# EAGLE design v3 (EAGLE 8.5.1)

## Sheet 1 of 2
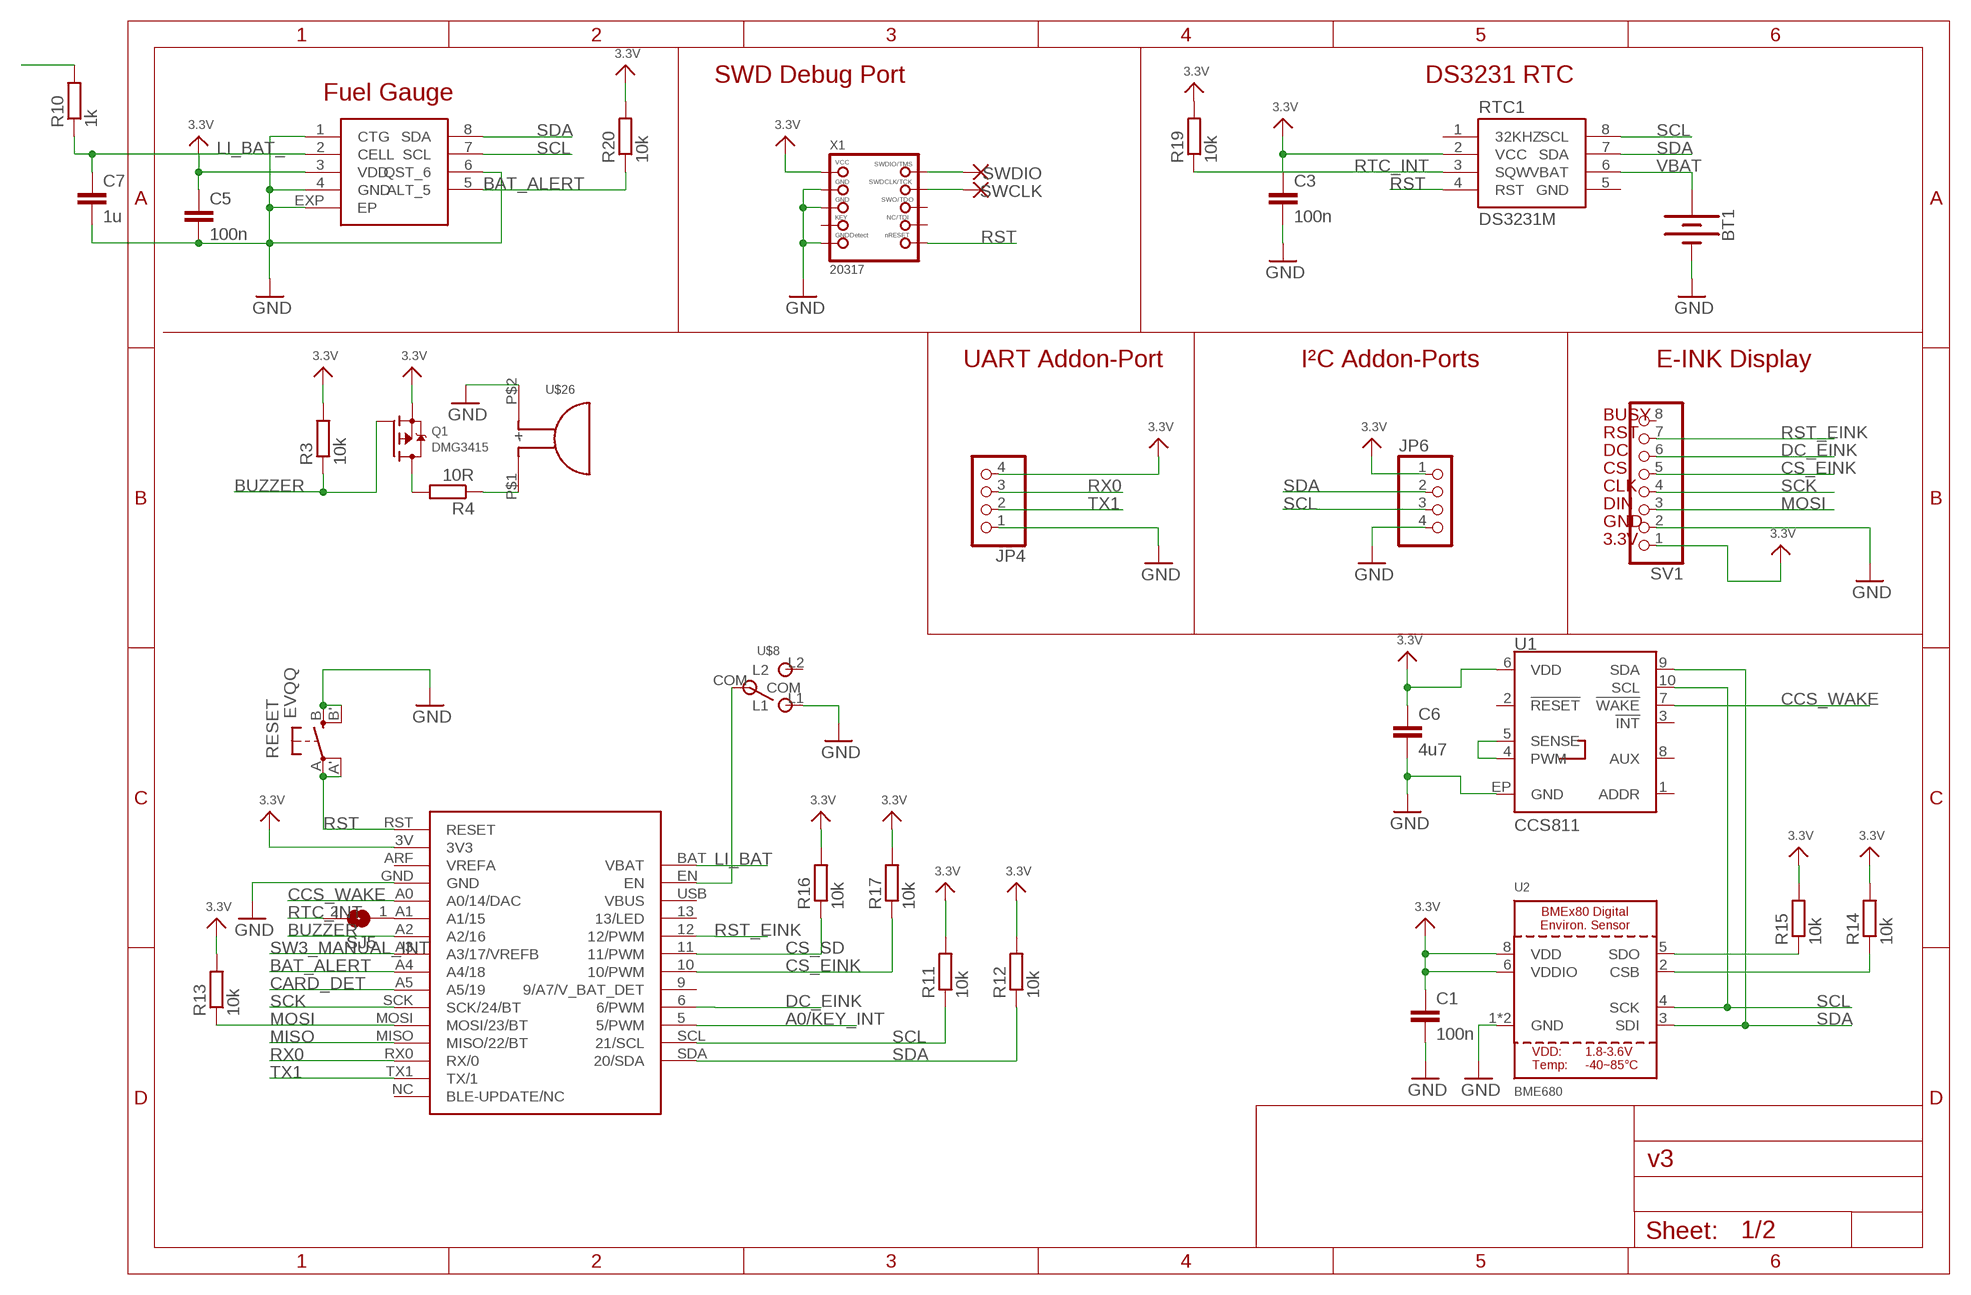
[diagram p0: schematic, sheet 1]

### Parts
BT1  BATTERY-12MM_SMD  [BATTCON_12MM]
C1  100n  C-EUC0805  [C0805]
C3  100n  C-EUC0805  [C0805]
C5  100n  C-EUC0805  [C0805]
C6  4u7  C-EUC0805  [C0805]
C7  1u  C-EUC0805  [C0805]
JP4  PINHD-1X04_2.54  [1X04]
JP6  PINHD-1X04_2.54-90°  [1X04/90]
Q1  DMG3415  MOSFET-PWIDE  [SOT23-WIDE]
R3  10k  R-EU_R0805  [R0805]
R4  10R  R-EU_R0805  [R0805]
R10  1k  R-EU_R0805  [R0805]
R11  10k  R-EU_R0805  [R0805]
R12  10k  R-EU_R0805  [R0805]
R13  10k  R-EU_R0805  [R0805]
R14  10k  R-EU_R0805  [R0805]
R15  10k  R-EU_R0805  [R0805]
R16  10k  R-EU_R0805  [R0805]
R17  10k  R-EU_R0805  [R0805]
R19  10k  R-EU_R0805  [R0805]
R20  10k  R-EU_R0805  [R0805]
RESET  EVQQ  SPST_TACT-EVQQ2  [EVQ-Q2]
RTC1  DS3231M  [SO08]
SJ5  SOLDERJUMPERCLOSED  [SOLDERJUMPER_CLOSEDWIRE]
SV1  PINHD-1X08_2.54  [1X08]
SWCLK  WIREPADSMD1,27-254  [SMD1,27-2,54]
SWDIO  WIREPADSMD1,27-254  [SMD1,27-2,54]
U1  CCS811  [LGA10]
U2  BME680  BME280  [BME280]
U$8  MSK-12C02_SMD_SPDT_SWITCH  [MSK-12C02]
U$15  FEATHER_M0  [FEATHER_M0]
U$26  DTS402G1  [DET402G1]
U$33  MAX17043  [DFN-2X3]
X1  20317  JTAG-CORTEXBOXPOSTS  [2X05_1.27MM_BOX_POSTS]

### Nets
3.3V: C1.1 C3.1 C5.1 C6.1 JP4.4 JP6.1 Q1.2(S) R3.2 R11.2 R12.2 R13.2 R14.2 R15.2 R16.2 R17.2 R19.2 R20.2 RTC1.2(VCC) SV1.1 U1.6(VDD) U2.6(VDDIO) U2.8(VDD) U$15.3V(3V3) U$33.3(VDD) X1.1(VCC) ; also sheet 2
A0/KEY_INT: U$15.5(5/PWM) ; also sheet 2
BAT_ALERT: R20.1 U$15.A4(A4/18) U$33.5(ALT_5)
BME_CSB: R14.1 U2.2(CSB)
BME_SDO: R15.1 U2.5(SDO)
BUZZER: Q1.1(G) R3.1 U$15.A2(A2/16)
CARD_DET: U$15.A5(A5/19) ; also sheet 2
CCS_WAKE: U1.7(!WAKE!) U$15.A0(A0/14/DAC)
CS_EINK: R17.1 SV1.5 U$15.10(10/PWM)
CS_SD: R16.1 U$15.11(11/PWM) ; also sheet 2
DC_EINK: SV1.6 U$15.6(6/PWM)
EN: U$8.COM U$15.EN
GND: BT1.GND(-) C1.2 C3.2 C5.2 C6.2 C7.2 JP4.1 JP6.4 RESET.B'(S1) RESET.B(S) SV1.2 U1.EP(GND) U2.1(GND) U2.7(GND) U$8.L1 U$15.GND U$26.P$2(-) U$33.1(CTG) U$33.4(GND) U$33.6(QST_6) U$33.EXP(EP) X1.3(GND) X1.5(GND) X1.9(GNDDETECT) ; also sheet 2
LI_BAT: R10.2 U$15.BAT(VBAT)
LI_BAT_: C7.1 R10.1 U$33.2(CELL)
MISO: U$15.MISO(MISO/22/BT) ; also sheet 2
MOSI: R13.1 SV1.3 U$15.MOSI(MOSI/23/BT) ; also sheet 2
N$8: Q1.3(D) R4.2
N$9: R4.1 U$26.P$1(+)
RST: RESET.A'(P1) RESET.A(P) RTC1.4(RST) U$15.RST(RESET) X1.10(NRESET)
RST_EINK: SV1.7 U$15.12(12/PWM)
RTC_INT: R19.1 RTC1.3(SQW) SJ5.2
RTC_INT_: SJ5.1 U$15.A1(A1/15)
RX0: JP4.3 U$15.RX0(RX/0)
SCK: SV1.4 U$15.SCK(SCK/24/BT) ; also sheet 2
SCL: JP6.3 R11.1 RTC1.8(SCL) U1.10(SCL) U2.4(SCK) U$15.SCL(21/SCL) U$33.7(SCL) ; also sheet 2
SDA: JP6.2 R12.1 RTC1.7(SDA) U1.9(SDA) U2.3(SDI) U$15.SDA(20/SDA) U$33.8(SDA) ; also sheet 2
SENSE_PWM: U1.4(PWM) U1.5(SENSE)
SW3_MANUAL_INT: U$15.A3(A3/17/VREFB) ; also sheet 2
SWCLK: SWCLK.1(P) X1.4(SWDCLK)
SWDIO: SWDIO.1(P) X1.2(SWDIO)
TX1: JP4.2 U$15.TX1(TX/1)
VBAT: BT1.PWR@1(+) RTC1.6(VBAT)
Unconnected: RTC1.1(32KHZ) SV1.8 U1.1(ADDR) U1.2(!RESET!) U1.3(!INT!) U1.8(AUX) U$8.L2 U$15.9(9/A7/V_BAT_DET) U$15.13(13/LED) U$15.ARF(VREFA) U$15.NC(BLE-UPDATE/NC) U$15.USB(VBUS) X1.6(SWO) X1.7(KEY) X1.8(TDI)

### Notes on the sheet
- SWD Debug Port | DS3231 RTC
- Fuel Gauge
- UART Addon-Port | I²C Addon-Ports | E-INK Display
- BUSY
- RST
- DC
- CS
- CLK
- DIN
- GND
- 3.3V

## Sheet 2 of 2
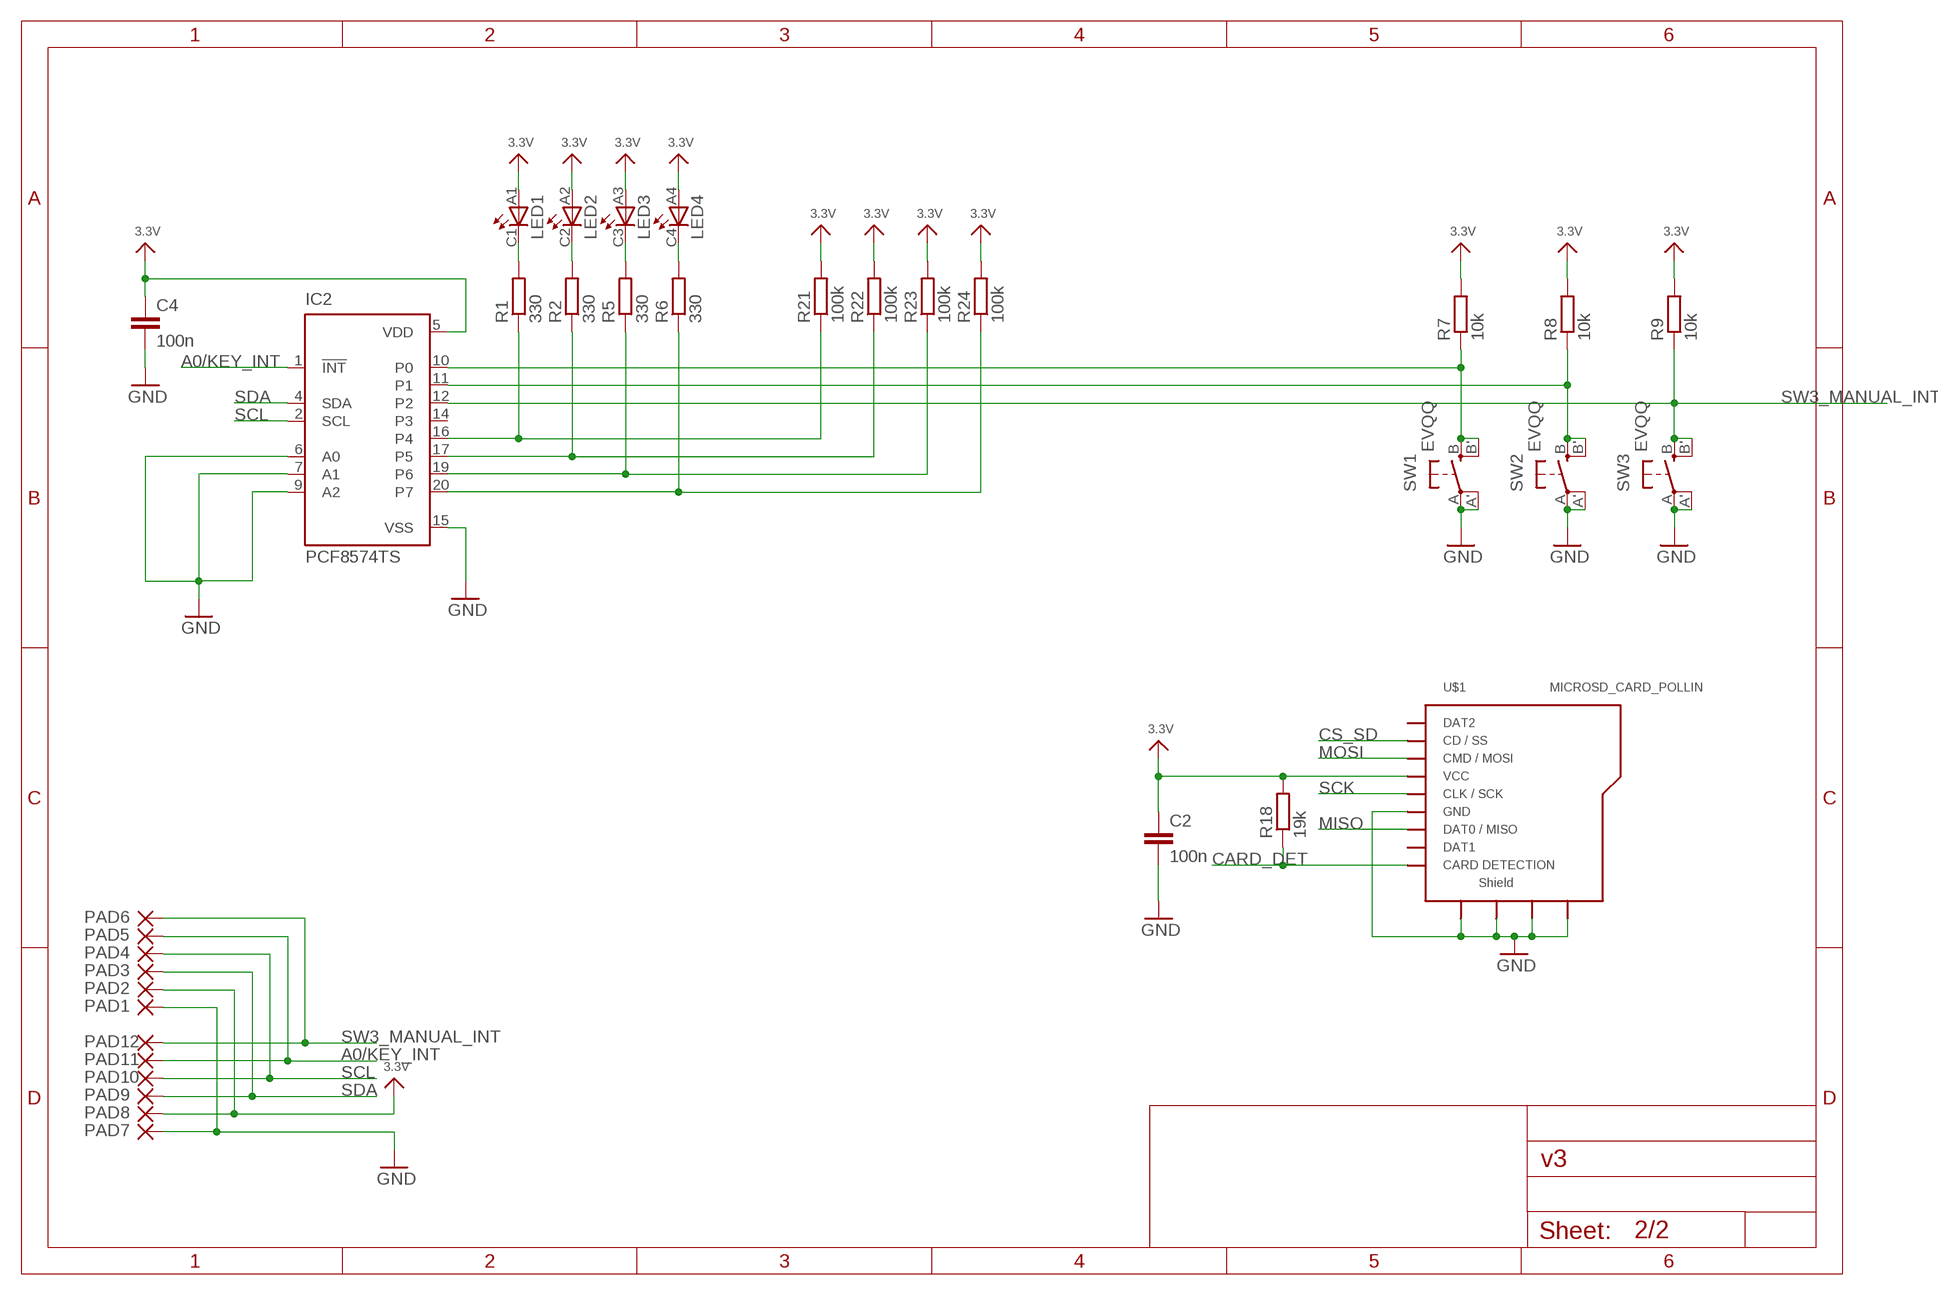
[diagram p1: schematic, sheet 2]

### Parts
C2  100n  C-EUC0805  [C0805]
C4  100n  C-EUC0805  [C0805]
IC2  PCF8574TS  [SSOP20]
PAD1  WIREPADSMD1,27-254  [SMD1,27-2,54]
PAD2  WIREPADSMD1,27-254  [SMD1,27-2,54]
PAD3  WIREPADSMD1,27-254  [SMD1,27-2,54]
PAD4  WIREPADSMD1,27-254  [SMD1,27-2,54]
PAD5  WIREPADSMD1,27-254  [SMD1,27-2,54]
PAD6  WIREPADSMD1,27-254  [SMD1,27-2,54]
PAD7  WIREPADSMD1,27-254  [SMD1,27-2,54]
PAD8  WIREPADSMD1,27-254  [SMD1,27-2,54]
PAD9  WIREPADSMD1,27-254  [SMD1,27-2,54]
PAD10  WIREPADSMD1,27-254  [SMD1,27-2,54]
PAD11  WIREPADSMD1,27-254  [SMD1,27-2,54]
PAD12  WIREPADSMD1,27-254  [SMD1,27-2,54]
R1  330  R-EU_R0805  [R0805]
R2  330  R-EU_R0805  [R0805]
R5  330  R-EU_R0805  [R0805]
R6  330  R-EU_R0805  [R0805]
R7  10k  R-EU_R0805  [R0805]
R8  10k  R-EU_R0805  [R0805]
R9  10k  R-EU_R0805  [R0805]
R18  19k  R-EU_R0805  [R0805]
R21  100k  R-EU_R0805  [R0805]
R22  100k  R-EU_R0805  [R0805]
R23  100k  R-EU_R0805  [R0805]
R24  100k  R-EU_R0805  [R0805]
SW1  EVQQ  SPST_TACT-EVQQ2  [EVQ-Q2]
SW2  EVQQ  SPST_TACT-EVQQ2  [EVQ-Q2]
SW3  EVQQ  SPST_TACT-EVQQ2  [EVQ-Q2]
U$1  MICROSD_CARD_POLLIN  [MR**-AP*03**]
U$5  LED_LIGHTGUIDE  [LPA-C041301S-X]

### Nets
3.3V: C2.1 C4.1 IC2.5(VDD) PAD2.1(P) PAD8.1(P) R7.2 R8.2 R9.2 R18.2 R21.2 R22.2 R23.2 R24.2 U$1.VCC U$5.A1 U$5.A2 U$5.A3 U$5.A4 ; also sheet 1
A0/KEY_INT: IC2.1(!INT) PAD5.1(P) PAD11.1(P) ; also sheet 1
CARD_DET: R18.1 U$1.CARD_DETECTION(CARD_D) ; also sheet 1
CS_SD: U$1.DAT3/CS(CD/SS) ; also sheet 1
GND: C2.2 C4.2 IC2.6(A0) IC2.7(A1) IC2.9(A2) IC2.15(VSS) PAD1.1(P) PAD7.1(P) SW1.A'(P1) SW1.A(P) SW2.A'(P1) SW2.A(P) SW3.A'(P1) SW3.A(P) U$1.GND U$1.SHD_1(SHD1) U$1.SHD_2(SHD2) U$1.SHD_3(SHD3) U$1.SHD_4(SHD4) ; also sheet 1
LED1: IC2.16(P4) R1.1 R21.1
LED1_: R1.2 U$5.C1
LED2: IC2.17(P5) R2.1 R22.1
LED2_: R2.2 U$5.C2
LED3: IC2.19(P6) R5.1 R23.1
LED3_: R5.2 U$5.C3
LED4: IC2.20(P7) R6.1 R24.1
LED4_: R6.2 U$5.C4
MISO: U$1.DAT0(DAT0/MISO) ; also sheet 1
MOSI: U$1.CMD(CMD/MOSI) ; also sheet 1
SCK: U$1.CLK(CLK/SCK) ; also sheet 1
SCL: IC2.2(SCL) PAD4.1(P) PAD10.1(P) ; also sheet 1
SDA: IC2.4(SDA) PAD3.1(P) PAD9.1(P) ; also sheet 1
SW1: IC2.10(P0) R7.1 SW1.B'(S1) SW1.B(S)
SW2: IC2.11(P1) R8.1 SW2.B'(S1) SW2.B(S)
SW3_MANUAL_INT: IC2.12(P2) PAD6.1(P) PAD12.1(P) R9.1 SW3.B'(S1) SW3.B(S) ; also sheet 1
Unconnected: IC2.14(P3) U$1.DAT1 U$1.DAT2

## Power pins joined to a net without a drawn wire
GND: RTC1.5(GND)

## Library data of the parts
BT1 = SparkFun-Batteries:BATTERY: Battery - Single Cell A variety of battery chemistries, sizes, and footprints. Device List: 20MM_PTH - Coin Cell Battery Holder - 20mm (PTH) 6.8MM_PTH - Coin Cell Battery Holder - 6.8MM(SMD) 12MM_SMD - Coin Cell Battery Holder - 12mm (SMD) 12MM_PTH - Coin Cell Battery Holder - 12mm (PTH) 20MM_SMD - 20mm Coin Cell Battery Holder (SMD) (2 legs) Used on the Big Time Watch Kit 20MM_SMD_4LEGS - Coin Cell Battery Holder - 20mm (SMD) 20MM_SMD_4LEGS_OVERPASTE - Coin Cell Battery Holder - 20mm (SMD) (Over-paste on the legs) 24.5MM_PTH - Coin Cell Battery Holder - 24.5mm (PTH) 9V - 9V Battery Holder - PC Mount Used on the SparkFun SparkPunk Sound Kit and SparkFun SparkPunk Sequencer Kit 18650 - Battery Holder - 18650 (PTH) AA - Battery Holder - 1xAA (PTH) AAA - Battery Holder - 1xAAA (PTH) AA_KIT - Battery Holder - 1xAA (PTH) Special kit package - pads only have exposed copper on one side of the board. AAA_KIT - Battery Holder - 1xAAA (PTH) Special kit package - pads only have exposed copper on one side of the board.; PROD_ID: BATT-08044; SF_SKU: PRT-10592
C1-C7 = rcl:C-EU: CAPACITOR, European symbol
IC2 = micro-philips:PCF8574: I2C-Bus Remote 8-bit I/O expander http://www.semiconductors.philips.com/acrobat_download/datasheets/PCF8574_4.pdf; MPN: PCF8574TS/3,118; OC_FARNELL: 1506644; OC_NEWARK: 70R6873
JP4 JP6 = pinhead-2:PINHD-1X04: PIN HEADER
PAD1-PAD12 SWCLK SWDIO = wirepad:WIREPAD: Wire PAD connect wire on PCB
Q1 = microbuilder:MOSFET-P: P-Channel Mosfet LEGEND VDS: Voltage Drain-Source ID: Drain Current RDS(ON): Drain-Source On-State Resistance VGS(TH): Gate-Source Threshold Voltage CISS: Drain-Source Input Capacitance SOT-23 Name VDS ID RDS(ON) VGS(TH) CISS Order Number IRLML5103 30V 760mA 600 mOhm -- 75pF @ 25V Digikey: IRLML5103PBFCT-ND IRLML6401 12V 4.3A 50 mOhm 950mV @ 250µA 830pF @ 10V Digikey: IRLML6401PBFTR-ND NTR0202PL 20V 400mA 800 mOhm 2.3V @ 250uA 70pF @ 5V Digikey: NTR0202PLT1GOSTR-ND NTR4101PT1G 20V 1.8A 85 mOhm 1.2V @ 250uA 675pF @ 10V Digikey: NTR4101PT1GOSCT-ND DMP2004K 20V 600mA 900 mOhm 1V @ 250uA 175pF @ 16V Digikey: DMP2004KDICT-ND PMV65XP 20V 3.9A 76 mOhm 950mV @ 1mA 725pF @ 20V Digikey: 568-2358-2-ND TO-252 Name VDS ID RDS(ON) VGS(TH) CISS Order Number AOD417 30V 25A 34 mOhm 3V @ 250µA 920pF @ 15V Digikey: 785-1106-2-ND
R1-R24 = rcl:R-EU_: RESISTOR, European symbol
RESET SW1-SW3 = adafruit:SPST_TACT: SMT 6mm switch, EVQQ2 series http://www.ladyada.net/library/eagle
RTC1 = SparkFun-Clocks:DS3231M: DS3231M Real Time Clock Accuracy +/-5ppm. Battery Backup. 2.3V to 5.5V. Datasheet SparkFun Products CryptoCape (DEV-12773) SparkFun CryptoShield (DEV-13183); PROD_ID: IC-11985
SJ5 = microbuilder:SOLDERJUMPER: SMD Solder JUMPER Solder the two pads together to create a connection, or remove the solder to break it. REFLOW - Use this footprint for solder paste and reflow ovens. WAVE - Use this footprint for hand-soldering (larger pads). CLOSED - Has a trace between the two pads to ensure it is closed by default. The trace needs to be cut to disable the jumper, and can be closed again by creating a solder bridge between the two pads.
SV1 = pinhead-2:PINHD-1X08: PIN HEADER
U1 = CCS811_Breakout_Temp:CCS811: AMS CCS811 – I2C Digital Gas Sensor Ultra-Low Power Digital Gas Sensor for Monitoring Indoor Air Quality AMS Product Page <http://ams.com/eng/Products/Environmental-Sensors/Gas-Sensors/CCS811> SparkFun Products:; PROD_ID: IC-13607
U2 = microbuilder:BME280: BME280 - Environmental Sensor (I2C + SPI)
U$1 = 000_eigene_Bauteile:MICROSD_CARD_POLLIN
U$5 = 000_Simons_Eigene:LED_LIGHTGUIDE
U$8 = 000_Simons_Eigene:MSK-12C02_SMD_SPDT_SWITCH: Footprint of the VIMEX MSK-12C02 SPDT SMD Switch Created by mzst on 17-Jan-2016
U$15 = 000_Simons_Eigene:FEATHER_M0
U$26 = 000_Simons_Eigene:DTS402G1
U$33 = MAX17043:MAX17043
X1 = microbuilder:JTAG-CORTEX: Serial Wire (SW-DP) Connector Standard 0.05" 10-pin connector is for use with the Cortex M and Cortex A SWD (serial wire debugger) interface (SW-DP) Connectors 2x05_1.27MM_SMT - Inexpensive surface-mount header with bare pins, compatible with standard 10-pin SWD cables (4UCON: 16846) 2x05_1.27MM_BOX_NOPOSTS - Polarised surface-mount box (4UCON with caps: 19735, without caps: 15117 2x05_1.27MM_BOX_POSTS - Polarised surface-mount box with mounting holes (4UCON: 20317) Pinout: http://infocenter.arm.com/help/topic/com.arm.doc.faqs/attached/13634/cortex_debug_connectors.pdf http://www.keil.com/peripherals/coresight/connectors.asp

## Board
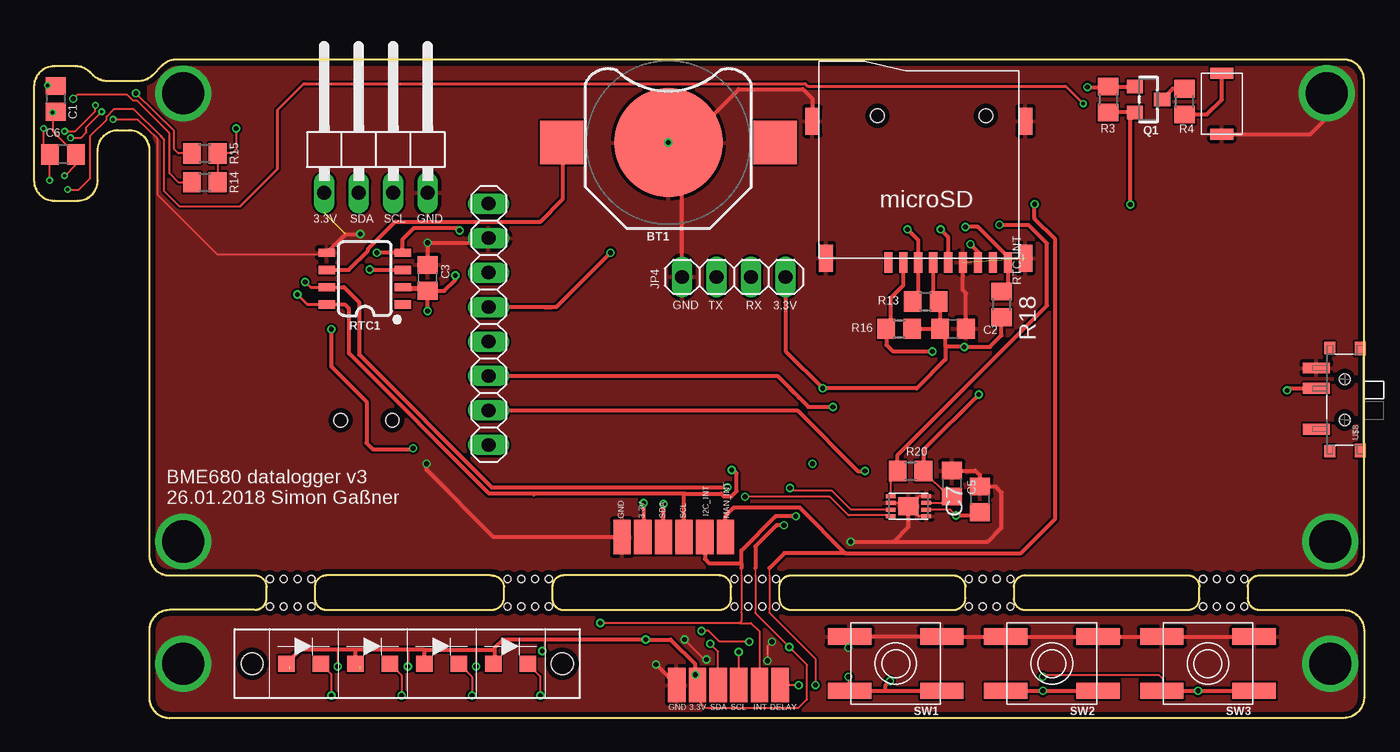
[diagram p2: board, top side]
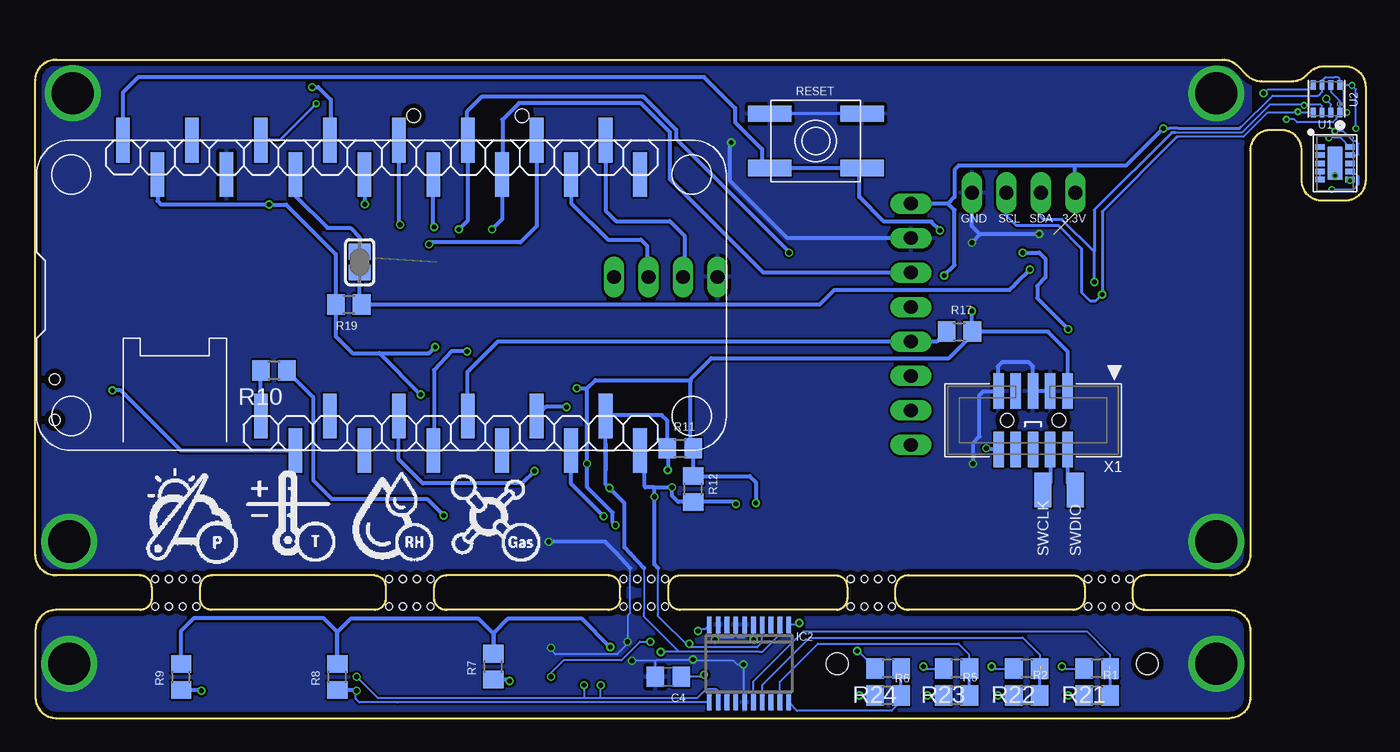
[diagram p3: board, bottom side, seen from below]

Size 98 x 48.5 mm. Coordinates in mm from the lower left corner, seen from the top.
Outline: 72 segments
Copper layers (1*16): Top 0.0356mm / dielectric 1.5011mm / Bottom 0.0356mm
Design rules "oshpark-2layer *": minimum track width 6mil, minimum drill 13mil, track to track 6mil, track to pad 6mil, pad to pad 6mil, via to via 6mil, smd to smd 6mil, copper to edge 15mil, drill to drill 6mil, minimum pad ring 5mil, minimum via ring 5mil, stop-mask expansion 2.5mil, vias tented up to drill 0mil, thermal gap 10mil
Holes 0.51 mm at 17.39,10.25 18.41,10.25 19.42,10.25 20.44,10.25 17.39,8.21 18.41,8.21 19.42,8.21 20.44,8.21 86.13,10.25 87.15,10.25 88.16,10.25 89.18,10.25 86.13,8.21 87.15,8.21 88.16,8.21 89.18,8.21 51.62,10.25 52.63,10.25 53.65,10.25 54.67,10.25 51.62,8.21 52.63,8.21 53.65,8.21 54.67,8.21 34.89,10.25 35.91,10.25 36.92,10.25 37.94,10.25 34.89,8.21 35.91,8.21 36.92,8.21 37.94,8.21 68.89,10.25 69.91,10.25 70.92,10.25 71.94,10.25 68.89,8.21 69.91,8.21 70.92,8.21 71.94,8.21

### Footprints (pad centres in the part's own frame; a part is rotated, then mirrored left to right if it is on the bottom)
BATTCON_12MM = smd 8 x 8: GND 0,0 | smd 3.175 x 3.175: PWR@1 -7.874,0; PWR@2 7.874,0
C0805 = smd 1.3 x 1.5: 1 -0.95,0; 2 0.95,0
SSOP20 = smd 0.35 x 1.2: 1 -2.925,-2.85; 2 -2.275,-2.85; 3 -1.625,-2.85; 4 -0.975,-2.85; 5 -0.325,-2.85; 6 0.325,-2.85; 7 0.975,-2.85; 8 1.625,-2.85; 9 2.275,-2.85; 10 2.925,-2.85; 11 2.925,2.85; 12 2.275,2.85; 13 1.625,2.85; 14 0.975,2.85; 15 0.325,2.85; 16 -0.325,2.85; 17 -0.975,2.85; 18 -1.625,2.85; 19 -2.275,2.85; 20 -2.925,2.85
1X04 = drill 1.016 long: 1 -3.81,0; 2 -1.27,0; 3 1.27,0; 4 3.81,0
1X04/90 = drill 1.016 long: 1 -3.81,-3.81; 2 -1.27,-3.81; 3 1.27,-3.81; 4 3.81,-3.81
SMD1,27-2,54 = smd 1.27 x 2.54: 1 0,0
SOT23-WIDE = smd 1 x 1.2: 1 -0.95,-1; 2 0.95,-1; 3 0,1
R0805 = smd 1.3 x 1.5: 1 -0.95,0; 2 0.95,0
EVQ-Q2 = smd 3.2 x 1.2: A -3.4,-2; A' 3.4,-2; B -3.4,2; B' 3.4,2
SO08 = smd 0.6 x 1.2: 1 -1.905,-2.8; 2 -0.635,-2.8; 3 0.635,-2.8; 4 1.905,-2.8; 5 1.905,2.8; 6 0.635,2.8; 7 -0.635,2.8; 8 -1.905,2.8
SOLDERJUMPER_CLOSEDWIRE = smd 1.168 x 1.6: 1 -0.762,0; 2 0.762,0 | smd 0.635 x 0.203: WIRE 0,0
1X08 = drill 1.016 long: 1 -8.89,0; 2 -6.35,0; 3 -3.81,0; 4 -1.27,0; 5 1.27,0; 6 3.81,0; 7 6.35,0; 8 8.89,0
LGA10 = smd 0.7 x 0.4: 1 -1.1,1.2; 2 -1.1,0.6; 3 -1.1,0; 4 -1.1,-0.6; 5 -1.1,-1.2; 6 1.1,-1.2; 7 1.1,-0.6; 8 1.1,0; 9 1.1,0.6; 10 1.1,1.2 | smd 1.1 x 2.45: EP 0,0
BME280 = smd 0.7 x 0.35: 1 1.025,0.975; 2 1.025,0.325; 3 1.025,-0.325; 4 1.025,-0.975; 5 -1.025,-0.975; 6 -1.025,-0.325; 7 -1.025,0.325; 8 -1.025,0.975
MR**-AP*03** = smd 0.6 x 1.5: CARD_DETECTION -6.55,0.3; CLK -2.15,0.3; CMD 0.05,0.3; DAT0 -4.35,0.3; DAT1 -5.45,0.3; DAT2 2.25,0.3; DAT3/CS 1.15,0.3; GND -3.25,0.3; VCC -1.05,0.3 | smd 1 x 2: SHD_1 -7.85,0; SHD_2 6.85,0; SHD_3 -7.85,-10.1; SHD_4 7.85,-10.1 | hole 1: -4.95,-10.5; 3.05,-10.5
LPA-C041301S-X = smd 1.2 x 1.2: A1 -8.89,0; A2 -3.81,0; A3 1.27,0; A4 6.35,0; C1 -6.35,0; C2 -1.27,0; C3 3.81,0; C4 8.89,0 | hole 1.6: 11.43,0; -11.43,0
MSK-12C02 = smd 0.8 x 2: COM 0.823,2.1; L1 2.323,2.1; L2 -2.177,2.1 | smd 1 x 0.8: GND@1 -3.75,-1.125; GND@4 3.75,-1.125 | smd 0.9 x 0.8: GND@2 -3.8,1.125; GND@3 3.8,1.125 | hole 0.8: -1.5,0; 1.5,0
FEATHER_M0 = smd 1.016 x 3.302 bottom: 3V -16.51,-9.525; 5 13.97,10.795; 6 11.43,8.255; 9 8.89,10.795; 10 6.35,8.255; 11 3.81,10.795; 12 1.27,8.255; 13 -1.27,10.795; A0 -8.89,-12.065; A1 -6.35,-9.525; A2 -3.81,-12.065; A3 -1.27,-9.525; A4 1.27,-12.065; A5 3.81,-9.525; ARF -13.97,-12.065; BAT -8.89,8.255; EN -6.35,10.795; GND -11.43,-9.525; MISO 11.43,-12.065; MOSI 8.89,-9.525; NC 19.05,-9.525; RST -19.05,-12.065; RX0 13.97,-9.525; SCK 6.35,-12.065; SCL 16.51,8.255; SDA 19.05,10.795; TX1 16.51,-12.065; USB -3.81,8.255
DET402G1 = smd 1.676 x 0.813: P$1 0,2.25; P$2 0,-2.25
DFN-2X3 = smd 0.7 x 0.3: 1 -1.325,0.75; 2 -1.325,0.25; 3 -1.325,-0.25; 4 -1.325,-0.75; 5 1.325,-0.75; 6 1.325,-0.25; 7 1.325,0.25; 8 1.325,0.75 | smd 1.5 x 1.3: EXP 0,0
2X05_1.27MM_BOX_POSTS = smd 0.76 x 2.6: 1 -2.54,-2.15; 2 -2.54,2.15; 3 -1.27,-2.15; 4 -1.27,2.15; 5 0,-2.15; 6 0,2.15; 7 1.27,-2.15; 8 1.27,2.15; 9 2.54,-2.15; 10 2.54,2.15 | hole 1: -1.905,0; 1.905,0

### Placement (x,y rotation side)
BT1  46.74,42.39 0 top
C1  1.6,45.6 270 top
C2  67.72,28.67 0 top
C3  29.01,32.42 90 top
C4  51.38,3.03 180 bottom
C5  67.63,17.27 90 top
C6  2.14,41.51 0 top
C7  69.7,16.1 90 top
IC2  45.42,4 180 bottom
JP4  51.56,32.48 0 top
JP6  25.2,42.49 0 top
PAD1  43.33,13.33 0 top
PAD2  44.86,13.33 0 top
PAD3  46.38,13.33 0 top
PAD4  47.9,13.33 0 top
PAD5  49.43,13.33 0 top
PAD6  50.95,13.33 0 top
PAD7  47.36,2.42 0 top
PAD8  48.89,2.42 0 top
PAD9  50.41,2.42 0 top
PAD10  51.93,2.42 0 top
PAD11  53.46,2.42 0 top
PAD12  54.98,2.42 0 top
Q1  82.11,45.55 270 top
R1  19.78,1.66 180 bottom
R2  24.96,1.66 180 bottom
R3  79.15,45.55 270 top
R4  84.79,45.4 90 top
R5  30.14,1.66 180 bottom
R6  35.17,1.66 180 bottom
R7  64.26,3.78 90 bottom
R8  75.76,3.02 90 bottom
R9  87.26,3.02 90 bottom
R10  80.43,25.59 180 bottom
R11  50.5,19.86 0 bottom
R12  49.53,16.87 90 bottom
R13  65.7,30.68 0 top
R14  12.59,39.46 0 top
R15  12.59,41.59 0 top
R16  63.75,28.67 0 top
R17  29.92,28.45 0 bottom
R18  71.29,30.46 270 top
R19  74.92,30.45 180 bottom
R20  64.58,18.19 0 top
R21  19.78,3.64 180 bottom
R22  24.96,3.64 180 bottom
R23  30.14,3.64 180 bottom
R24  35.17,3.64 180 bottom
RESET  40.5,42.5 0 bottom
RTC1  24.38,32.36 90 top
SJ5  74.12,33.58 270 bottom
SV1  33.5,29 270 top
SW1  63.5,4 180 top
SW2  75,4 180 top
SW3  86.5,4 180 top
SWCLK  23.78,16.79 0 bottom
SWDIO  21.39,16.79 0 bottom
U1  2.25,40.85 0 bottom
U2  2.88,45.6 270 bottom
U$1  65.2,33.86 180 top
U$5  27.5,4 0 top
U$8  96.59,23.45 90 top
U$14  GASLOGO45MM  [BME680_LOGO_30MM]  90.25,10.96 0 bottom
U$15  72.5,30.5 180 top
U$26  87.53,45.25 0 top
U$33  64.43,15.6 180 top
X1  24.5,21.93 180 bottom

### Tracks (layer width: path | path; a pad name or v marks a point on that pad's centre or on a via)
3.3V  (via drill 0.25, 0.25 pad 0.51, 0.35, 0.35 pad 0.51)
  Top 0.102: 53.15,7.76 53.15,8 | 53.15,11.03 53.15,10.5
  Top 0.152: 53.15,7.76 53.15,7.72 55.58,5.3 | 53.15,10.5 53.15,8 | v48.73,3.18 PAD8.1 48.89,1.97 48.73,1.81 48.73,1.51 49.5,0.75 56.33,0.75 56.96,1.38 56.96,3.92 v55.65,5.23 | U$33.3 67.16,15.85 C5.1 67.4,16.32 R20.2 | C1.1 1.05,46.55 v1,46.6 | R14.2 R15.2 14.6,41.59 14.9,41.89 v14.9,43.42 | v0.71,43.42 0.71,41.99 C6.1 1.15,41.48 v1.15,39.6 | 37.61,5.78 37.61,5.09 v37.46,4.94 | 32.58,5.01 v32.58,3.79 | 27.55,5.01 v27.55,3.79 | 22.37,5.01 v22.37,3.79
  Top 0.305: v29.01,29.98 C3.1 30.23,31.47 31.05,32.29 v31.05,32.6 | R16.2 C2.1 | C2.1 66.77,30.57 R13.2 66.25,31.08 U$1.VCC 66.27,32.57 | PAD2.1 44.86,14 44.92,14.07 v44.92,15.83 | v55.27,14.2 54.72,14.2 53.15,12.63 53.15,11.03 | v48.73,3.18 48.73,3.95 46.91,5.78 v45.08,5.78 37.61,5.78 34.56,5.78 33.95,5.17 33.95,5.01 | v58.12,24.28 58.27,24.28 | C2.1 67.17,28.27 67.17,27.33 | 67.17,27.33 67.17,26.42 65.04,24.28 v58.12,24.28 | 67.17,27.33 v68.55,27.33 70.44,27.33 71.29,28.18 R18.2 | JP4.4 55.37,27.03 v58.12,24.28 | v69.61,23.83 65.53,19.75 R20.2 | 33.95,5.01 33.95,4.1 U$5.A4 | 23.74,5.01 22.37,5.01 19.62,5.01 U$5.A1 | 28.77,5.01 27.55,5.01 23.74,5.01 | 28.77,5.01 32.58,5.01 33.95,5.01 | U$5.A2 23.69,4.96 23.74,5.01 | U$5.A3 28.77,5.01 | R3.2 Q1.2 80.79,44.13 v80.79,37.82 | 55.58,5.3 v55.65,5.23
  Top 0.381: RTC1.2 27.25,31.65 28.55,31.65 28.74,31.47 C3.1
  Bottom 0.152: IC2.5 45.1,5.8 v45.08,5.78 | v48.73,3.18 49.04,3.04 C4.1 | 9.27,43.44 9.27,43.43 9.26,43.42 6.85,45.83 3.49,45.83 3.21,46.12 U2.6 3.21,46.96 2.96,47.21 2.29,47.21 2.29,47.2 2.04,47.2 1.91,47.07 U2.8 1.88,46.6 v1,46.6 0.71,46.31 v0.71,43.42 | U1.6 v1.15,39.6 | v37.46,4.94 37.42,4.94 R24.2 | v32.58,3.79 32.43,3.64 R23.2 | v27.55,3.79 27.4,3.64 R22.2 | v22.37,3.79 22.22,3.64 R21.2
  Bottom 0.203: v14.9,43.42 14.49,43.42 14.44,43.47 13.87,43.47 13.84,43.44 9.27,43.44 9.2,43.51
  Bottom 0.305: U$15.3V 89.01,38.08 88.75,37.82 86.83,37.82 | 86.83,37.82 86.81,37.82 | R11.2 49.69,19.83 | v55.27,14.2 55.48,14.4 55.48,15.12 57.35,17 v57.35,18.73 57.35,24.28 | R11.2 49.53,19.85 R12.2 45.38,17.82 44.92,17.36 v44.92,15.83 | v58.12,24.28 57.35,24.28 | 57.35,24.28 56.74,24.89 49.8,24.89 | R11.2 49.73,20.05 49.73,24.83 49.8,24.89 | 29.01,28.49 v29.01,29.98 | 29.01,28.49 R17.2 23.41,28.45 21.96,27.01 | 29.01,28.49 29.01,28.18 30.68,26.5 48.19,26.5 49.8,24.89 | 21.96,27.01 | 72.66,26.87 74.64,26.87 75.87,28.1 R19.2 75.87,34.17 79.52,37.82 v80.79,37.82 86.83,37.82 | 72.66,26.87 69,26.87 v68.55,27.33 | 72.66,26.87 v69.61,23.83 | 21.96,27.01 X1.1 | v31.05,32.6 30.29,33.36 30.29,37.4 30.78,37.89 | 30.78,37.89 SV1.1 | v14.9,43.42 17.64,40.67 21.45,40.67 | v55.65,5.23 57.73,7.3 63.21,7.3 64.26,6.25 R7.2 64.26,6.22 65.34,7.3 74.79,7.3 75.76,6.33 R8.2 75.76,6.34 76.78,7.35 86.33,7.35 87.29,6.38 87.29,4 R9.2 | 30.78,37.89 30.29,38.38 30.29,40.37 29.99,40.67 21.45,40.67 | 21.45,40.67 21.45,38.75 JP6.1
A0/KEY_INT  (via drill 0.35)
  Top 0.102: 52.12,11.03 52.12,10.5 | 52.12,7.98 52.12,7.76
  Top 0.152: 52.01,7 52.85,7 53.46,6.38 PAD11.1 | 52.01,7 v41.72,7 | 51.97,7 52.01,7.03 | 52.12,7.76 52.12,7.15 52.01,7.03 | 52.12,10.5 52.12,7.98 | 52.01,7.03 52.01,7
  Top 0.305: v56.13,14.85 54.65,14.85 52.12,12.33 52.12,11.41 | PAD5.1 49.43,11.72 49.73,11.41 52.12,11.41 | 52.12,11.41 52.12,11.03
  Bottom 0.152: IC2.1 41.86,6.85 v41.72,7
  Bottom 0.305: U$15.5 58.53,17.25 v56.13,14.85
BAT_ALERT  (via drill 0.35)
  Top 0.152: R20.1 63.11,17.66 U$33.5
  Top 0.305: v71.14,36.32 73.27,36.32 74.64,34.95 74.64,30.38 63.63,19.37 R20.1
  Bottom 0.305: U$15.A4 71.23,36.42 v71.14,36.32
BME_CSB  (via drill 0.35)
  Top 0.152: R14.1 10.63,39.46 9.95,40.14 9.95,43.11 7.58,45.48 7.29,45.48 6.84,45.93 3.23,45.93 v2.9,45.6
  Bottom 0.152: U2.2 2.56,45.2 2.88,45.53 2.88,45.59 v2.9,45.6
BME_SDO  (via drill 0.35)
  Top 0.152: v7.51,46.01 10.33,43.27 10.33,41.89 10.63,41.59 R15.1
  Bottom 0.152: U2.5 4.2,46.29 7.23,46.29 v7.51,46.01
BUZZER  (via drill 0.35)
  Top 0.305: 79.67,46.5 Q1.1 | 79.67,46.5 R3.1 | v77.62,46.47 79.64,46.47 79.67,46.5
  Bottom 0.305: v77.62,46.47 77.17,46.47 76.25,45.55 76.25,42.62 U$15.A2
CARD_DET  (via drill 0.35)
  Top 0.305: v68.63,36.17 69.55,36.17 71.75,33.96 U$1.CARD_DETECTION 71.75,31.88 R18.1
  Bottom 0.305: v68.63,36.17 68.69,36.11 U$15.A5
CCS_WAKE  (via drill 0.25 pad 0.51)
  Top 0.152: v2.48,38.92 3.32,38.92 4.16,39.76 4.16,42.89 5.35,44.08 5.35,44.29 5.93,44.87 7.33,44.87 9.32,42.88 9.41,42.79 9.57,42.63 9.57,38.85 10.71,37.7 15.21,37.7
  Top 0.203: 15.21,37.7 17.95,40.45 17.95,44.79 19.88,46.72 56.83,46.72 57.01,46.54 76.01,46.54 v77.31,45.25
  Bottom 0.152: U1.7 0.98,40.08 0.71,40.08 0.53,39.91 0.53,39.3 0.91,38.92 v2.48,38.92
  Bottom 0.203: v77.31,45.25 79.99,42.56 U$15.A0
CS_EINK
  Bottom 0.305: U$15.10 66.19,22.29 66.19,25.47 63.94,27.73 SV1.5 | 33.8,27.73 SV1.5 | R17.1 31.6,27.73 SV1.5
CS_SD  (via drill 0.35)
  Top 0.305: v66.19,27 63.3,27 62.8,27.49 R16.1 63.15,29.01 63.15,30.96 64.05,31.87 U$1.DAT3/CS
  Bottom 0.305: U$15.11 68.63,19.76 68.63,25.62 67.33,27.03 66.22,27.03 v66.19,27
DC_EINK  (via drill 0.35)
  Top 0.305: 56.35,23.61 55.77,24.19 | 56.35,23.61 57.05,22.91 v58.88,22.91 | SV1.6 54.77,25.19 56.35,23.61
  Bottom 0.305: 61.16,22.34 U$15.6 60.4,22.91 v58.88,22.91
EN  (via drill 0.35)
  Top 0.305: v92.32,24.13 92.47,24.28 U$8.COM
  Bottom 0.305: U$15.EN 87.28,19.7 91.71,24.13 v92.32,24.13
GND  (via drill 0.25, 0.25 pad 0.51, 0.35, 0.35 pad 0.51, 3.1)  (2 unrouted)
  Top 0.152: v47.94,5.78 49.41,4.31 v49.55,4.31 | v54.37,5.62 54.04,5.29 v54.04,4.22 | U$33.6 64.18,15.85 U$33.EXP | U$33.4 65.18,16.35 U$33.EXP | U$33.1 65.18,14.85 U$33.EXP | 1.43,44.58 C1.2 1.41,44.47 | 1.43,44.58 v1.38,44.6 | RTC1.5 21.43,34.12 13.53,34.12 9.11,38.54 9.11,42.66 7.6,44.09 v5.83,44.09 | 2.25,39.76 2.25,39.91 | 2.25,39.91 v2.25,39.94 | 2.25,39.91 3.09,40.75 C6.2 1.43,43.16 1.43,44.58 | SW2.A' 71.8,5.88 | v60.01,5.17 60.01,5.91 SW1.A'
  Top 0.305: C3.2 v29.01,35.01 33.16,35.01 SV1.2 | 48.12,41.39 BT1.GND | JP4.1 47.75,40.37 BT1.GND | C2.2 68.67,31.28 68.45,31.49 68.45,32.56 U$1.GND | U$26.P$2 94.03,43 95.37,44.33 95.37,45.89 v95.24,46.02 | U$33.EXP 64.43,14.07 63.34,12.99 | v45.84,3.95 PAD7.1 | v60.17,12.99 63.34,12.99 | BT1.GND 48.01,42.39 51.93,46.31 56.66,46.31 57.35,45.62 U$1.SHD_4 | RTC1.5 22.95,35.65 v24.05,35.65 | 63.34,12.99 70.27,12.99 71.29,14 71.29,16.6 70.83,17.05 C7.2 69.7,17.88 69.36,18.22 C5.2 | v28.92,18.73 28.92,18.27 33.86,13.33 PAD1.1 | SW1.A' SW1.A SW2.A' SW2.A SW3.A' SW3.A
  Bottom 0.102: 54.18,7.72 54.18,7.74 | 54.18,11.03 54.18,10.5 | 54.18,7.76 54.18,8.06
  Bottom 0.152: IC2.15 45.68,1.22 45.84,1.38 v45.84,3.95 46.3,3.95 46.6,4.25 49.5,4.25 v49.55,4.31 49.8,4.25 52.24,4.25 | IC2.9 47.7,6.11 47.67,6.08 | 47.67,6.08 47.51,5.93 46.6,5.93 46.4,6.13 | 46.4,6.13 IC2.7 | IC2.6 45.75,6.02 45.84,5.93 46.2,5.93 46.4,6.13 | v47.94,5.78 47.67,6.05 47.67,6.08 | 52.24,4.25 54.01,4.25 v54.04,4.22 | C4.2 52.33,4.17 52.24,4.25 | 54.18,7.76 54.18,7.72 54.37,7.53 v54.37,5.62 54.37,5.47 55.15,4.7 59.69,4.7 60.01,5.01 v60.01,5.17 | 54.18,8.06 54.18,10.5 | U2.7 2.56,46.12 1.89,45.45 1.89,44.59 U2.1 | U2.1 2.16,44.33 2.16,44.13 2.41,43.88 5.04,43.88 5.25,44.09 v5.83,44.09 | v1.38,44.6 1.89,44.6 U2.1 | U1.EP v2.25,39.94
  Bottom 0.203: RESET.B' RESET.B
  Bottom 0.305: v60.17,12.99 56.02,12.99 55.18,12.15 54.18,11.03 | 28.4,35.62 v29.01,35.01 | BT1.GND 46.84,42.29 46.84,39.58 42.61,35.35 SV1.2 | v28.92,18.73 28.92,20.25 28.44,20.74 28.44,23.78 28.16,24.06 27.06,24.06 X1.9 27.09,24.13 27.09,25.89 26.79,26.2 24.81,26.2 24.5,25.89 X1.5 X1.3 | v24.05,35.65 24.07,35.62 28.4,35.62 | 28.4,35.62 29.01,36.23 JP6.4
  Bottom 0.381: U$15.GND
  other vias: 95.5,13 95.5,4 11,13 11,4 46.74,42.39 11,46
  pour Top: 8.5,48.42 98.01,48.42 98.01,0 8.5,0
  pour Bottom: 8.5,48.42 98.01,48.42 98.01,0 8.5,0
LED1  (1 unrouted)
  Bottom 0.152: IC2.16 45.1,2.7 41.42,6.38 20.54,6.38 18.83,4.67 18.83,3.79
  Bottom 0.203: 18.83,3.79 R1.1
LED1_  (via drill 0.35)
  Top 0.152: U$5.C1 21.91,3.24 v21.91,1.66
  Bottom 0.152: v21.91,1.66 R1.2
LED2  (1 unrouted)
  Bottom 0.152: IC2.17 44.45,2.44 40.96,5.93 25.26,5.93 24.01,4.67 24.01,4.22 24.01,3.95 24.01,3.79
  Bottom 0.203: R2.1 24.01,3.79
LED2_  (via drill 0.35)
  Top 0.152: U$5.C2 27.09,3.14 v27.09,1.66
  Bottom 0.152: v27.09,1.66 R2.2
LED3
  Bottom 0.152: IC2.19 43.15,2.67 40.35,5.47 29.99,5.47 29.23,4.71 29.23,3.68 R23.1
  Bottom 0.203: R5.1 R23.1
LED3_  (via drill 0.35)
  Top 0.152: U$5.C3 32.27,3.04 v32.27,1.66
  Bottom 0.152: v32.27,1.66 R5.2
LED4
  Bottom 0.152: R6.1 34.22,1.24 34.93,0.53 41.88,0.53 IC2.20
  Bottom 0.203: R6.1 R24.1
LED4_  (via drill 0.35)
  Top 0.152: U$5.C4 37.3,3.09 v37.3,1.66
  Bottom 0.152: v37.3,1.66 R6.2
LI_BAT
  Bottom 0.305: U$15.BAT R10.2
LI_BAT_  (via drill 0.35)
  Top 0.152: v67.94,14.92 67.51,15.35 U$33.2
  Top 0.305: v67.94,14.92 69.47,14.92 C7.1
  Bottom 0.305: R10.1 77.54,23.64 77.54,17.51 76.17,16.14 69.16,16.14 v67.94,14.92
MISO  (via drill 0.35)
  Top 0.305: 69.55,33.69 U$1.DAT0 69.55,34.33 v69,34.88
  Bottom 0.305: U$15.MISO 61.07,36.23 62.27,35.04 68.85,35.04 v69,34.88
MOSI  (via drill 0.35)
  Top 0.305: 64.9,35.45 v64.36,35.99 65.15,35.2 U$1.CMD 65.15,31.09 R13.1 64.9,30.83
  Bottom 0.305: v64.36,35.99 63.61,36.74 U$15.MOSI 63.6,40.03 63.6,44.07 62.38,45.28 53.39,45.28 51.26,43.15 51.26,39.69 44.37,32.81 SV1.3
N$8
  Top 0.305: R4.2 83.91,46.35 Q1.3
N$9
  Top 0.305: R4.1 86.43,44.45 87.53,45.55 U$26.P$1
RST  (via drill 0.35)
  Top 0.305: v25.26,34.27 RTC1.4 27.18,35.27 28.01,36.1 31.17,36.1 v31.36,35.91 | v27.93,19.87 27.86,19.8 24.96,19.8 24.5,20.25 24.5,23.3 21.91,25.89 v21.91,28.64
  Bottom 0.305: v25.26,34.27 24.05,34.27 23.59,33.82 23.59,32.45 24.2,31.84 24.2,30.92 v21.91,28.64 | X1.10 27.84,19.78 v27.93,19.87 | U$15.RST 91.56,43.57 91.56,46.06 90.42,47.2 48.73,47.2 46.45,44.91 46.45,43.88 44.47,41.89 44.47,40.5 | RESET.A' 37.3,40.5 | 37.3,40.5 RESET.A 44.47,40.5 | 44.77,40.52 44.75,40.5 44.47,40.5 | 37.3,40.5 37.3,38.39 35.48,36.56 31.97,36.56 31.97,36.52 v31.36,35.91
RST_EINK  (via drill 0.35)
  Top 0.305: 33.54,22.69 SV1.7 56.24,22.65 60.71,18.19 v61.23,18.19
  Bottom 0.305: U$15.12 71.23,19.04 69.46,17.27 62.15,17.27 v61.23,18.19
RTC_INT  (via drill 0.35)
  Top 0.305: v24.74,33.03 27.15,33.03 RTC1.3
  Bottom 0.305: v24.74,33.03 25.67,32.09 25.81,31.96 26.23,31.53 28.77,31.53 39.13,31.53 40.22,30.45 R19.1 74.12,30.6 SJ5.2
RTC_INT_
  Bottom 0.305: U$15.A1 78.85,38.46 76.49,36.1 74.79,36.1 74.12,35.43 SJ5.1
RX0
  Bottom 0.305: U$15.RX0 58.53,37.93 55.83,35.23 53.39,35.23 52.93,34.77 52.93,32.28 JP4.3
SCK  (via drill 0.35)
  Top 0.305: v66.8,35.99 67.35,35.44 U$1.CLK | 37.61,30.27 SV1.4 | 37.61,30.27 38.18,30.27 | v42.48,34.27 38.48,30.27 37.61,30.27
  Bottom 0.305: v66.8,35.99 66.15,36.64 66.15,42.39 66.19,42.43 66.19,42.57 | 66.19,42.57 66.19,44.67 65.13,45.74 53.2,45.74 50.8,43.34 50.8,42.66 42.48,34.34 v42.48,34.27 | U$15.SCK 66.19,42.57
SCL  (via drill 0.25 pad 0.51, 0.35)
  Top 0.152: PAD10.1 v51.93,4.86 | U$33.7 60.19,15.35 58.79,16.75 55.9,16.75 v55.71,16.93 | v2.71,42.73 3.47,42.73 3.87,43.13 3.87,43.3 3.87,43.52 v5,44.65
  Top 0.203: v19.41,31.2 20.15,30.46 RTC1.8
  Top 0.305: RTC1.8 22.89,30.46 23.22,30.13 23.22,26.86 33.54,16.53 36.78,16.53 | v51.41,18.27 51.69,18.07 51.76,18.02 51.76,16.71 51.38,16.33 50.83,16.33 50.63,16.53 47.91,16.53 | 47.91,16.53 36.78,16.53 | 36.83,16.48 36.78,16.53 | PAD4.1 47.91,16.53
  Bottom 0.076: 53.15,7.98 53.15,8.06
  Bottom 0.102: 53.15,11.03 53.15,10.5 | 53.15,7.76 53.15,7.98
  Bottom 0.15: 44.67,4.89 44.44,4.89
  Bottom 0.152: 44.67,4.89 50.59,4.89 | 50.59,4.89 53.15,7.45 53.15,7.76 | 50.59,4.89 51.91,4.89 v51.93,4.86 | 53.15,10.5 53.15,8.06 | 13.89,42.81 9.01,42.81 7.24,44.58 5.15,44.58 5.07,44.58 | 44.44,4.89 43.15,6.18 IC2.2 | U1.10 1.83,42.73 v2.71,42.73 | U2.4 5.07,44.58 | v5,44.65 5.07,44.58
  Bottom 0.203: JP6.3 26.47,37.03 26.48,37.02 25.72,36.26 22.61,36.26 20.93,34.58 20.93,31.35 20.32,30.74 19.86,30.74 v19.41,31.2 19.41,37.29 13.89,42.81
  Bottom 0.305: 53.15,11.03 54.15,12.11 54.61,12.57 54.61,15.83 v55.71,16.93 55.99,17.21 U$15.SCL | U$15.SCL 55.96,18.27 55.98,18.29 | v51.41,18.27 51.41,19.83 R11.1 51.45,21.88 51.87,22.3 55.93,22.3 U$15.SCL
SDA  (via drill 0.25 pad 0.51, 0.35)
  Top 0.152: PAD9.1 50.41,4.89 v49.83,5.47 | U$33.8 63.03,14.92 60.01,14.92 58.64,16.29 v52.39,16.29 | v2.26,43.22 3.04,43.22 4.51,44.69 4.51,44.85 4.53,44.87 v4.53,45.12
  Top 0.203: v19.99,32.11 20.37,31.73 RTC1.7
  Top 0.305: RTC1.7 22.84,31.73 23.98,30.59 23.98,26.74 33.73,16.99 v51.1,16.99 | PAD3.1 v46.38,15.77
  Bottom 0.102: 52.12,10.5 52.12,11.04 | 52.12,7.76 52.12,7.98
  Bottom 0.152: IC2.4 44.49,6.81 44.49,5.54 44.84,5.19 49.83,5.19 | 49.83,5.19 v49.83,5.47 | 49.83,5.19 52.12,7.49 52.12,7.76 | 52.12,7.98 52.12,10.5 | 14.02,43.11 9.14,43.11 7.06,45.18 4.59,45.18 | U1.9 0.6,41.45 0.53,41.51 0.53,42.31 0.71,42.48 0.9,42.48 1.63,43.22 v2.26,43.22 | 3.22,44.93 3.21,44.91 U2.3 3.21,45.09 3.3,45.18 4.59,45.18 | v4.53,45.12 4.59,45.18
  Bottom 0.203: 19.99,34.33 22.37,36.71 23.74,36.71 24.05,37.02 24.05,38.57 JP6.2 | v19.99,32.11 19.99,34.33 | 14.02,43.11 14.29,43.11 19.99,37.42 19.99,34.33
  Bottom 0.305: v51.1,16.99 51.04,16.92 | U$15.SDA 53.12,19.38 53.12,17.05 53.06,16.99 52.39,16.99 | 52.39,16.99 v51.1,16.99 | 52.12,11.04 52.39,11.31 v52.39,16.29 52.39,16.99 | v46.38,15.77 46.53,15.92 R12.1 50.65,15.92 51.1,16.38 v51.1,16.99
SENSE_PWM
  Bottom 0.152: U1.5 U1.4
SW1  (via drill 0.35)
  Top 0.152: v52.7,5.62 50.5,5.62 49.71,6.41 v49.19,6.41 | v60.01,3.03 60.01,2.09 SW1.B'
  Top 0.305: SW1.B' 62.75,2 | 62.75,2 SW1.B | 62.75,2 62.75,2.42 v63.06,2.73
  Bottom 0.152: IC2.10 48.67,6.54 48.89,6.54 49.01,6.41 v49.19,6.41 | v52.7,5.62 53.46,5.62 54.83,4.25 59.1,4.25 60.01,3.34 v60.01,3.03
  Bottom 0.305: v63.06,2.73 63.16,2.83 R7.1
SW2  (via drill 0.35)
  Top 0.305: SW2.B v74.34,2 SW2.B'
  Bottom 0.152: IC2.11 71.34,1.15 74.14,1.15 74.41,1.43 74.41,2.07
  Bottom 0.305: R8.1 74.41,2.07 v74.34,2
SW3_MANUAL_INT  (via drill 0.35)
  Top 0.102: 54.18,8.02 54.18,7.76 | 54.18,11.03 54.18,10.5
  Top 0.152: 54.18,10.5 54.18,8.02 | v57.57,2.42 57.57,4.37 54.18,7.76 | v56.35,2.41 56.34,2.42 PAD12.1 | v74.34,3.03 74.49,3.18 82.87,3.18 83.18,2.88 83.18,2.08 SW3.B'
  Top 0.305: 59.77,12.15 56.41,15.51 55.86,15.51 51.56,15.51 50.95,14.9 PAD6.1 | 54.18,11.03 55.3,12.15 59.77,12.15 | v73.73,37.85 73.73,36.78 75.25,35.26 75.25,14.68 72.72,12.15 59.77,12.15 | SW3.B v85.77,2 SW3.B'
  Bottom 0.152: IC2.12 47.7,2 47.82,2.12 48.58,2.12 49.24,1.46 56.35,1.46 | 56.35,1.46 57.57,1.46 | v57.57,2.42 57.57,1.46 | 56.35,1.46 v56.35,2.41 | v74.34,3.03 72.76,1.46 57.57,1.46
  Bottom 0.305: v73.73,37.85 73.73,39.37 73.77,39.41 U$15.A3 | R9.1 85.84,2.07 v85.77,2
SWCLK
  Bottom 0.305: X1.4 23.23,17.34 SWCLK.1
SWDIO
  Bottom 0.305: X1.2 21.96,17.36 SWDIO.1
TX1
  Bottom 0.305: U$15.TX1 55.99,37.37 55.22,36.6 51.26,36.6 50.19,35.53 50.19,32.28 JP4.2
VBAT
  Top 0.305: RTC1.6 23.19,33 24.61,34.42 24.61,34.55 26.63,36.57 37.31,36.57 38.98,38.24 38.98,42.27 BT1.PWR@1 | 39.1,42.39 BT1.PWR@1 | 39.1,42.39 39.67,42.96 | 39.1,42.39 39.07,42.35 39.07,41.74 | BT1.PWR@1 38.63,42.63

### Text on the board
tPlace: 3.3V | SDA | SCL | GND | TX | RX | 3.3V | BME680 datalogger v3 / 26.01.2018 Simon Gaßner | GND | 3.3V | SDA | SCL | I2C_INT | MAN_INT | GND | 3.3V | SDA | SCL | INT | DELAY
tNames: RTC_INT | GND
bNames: 3.3V | SDA | SCL | GND